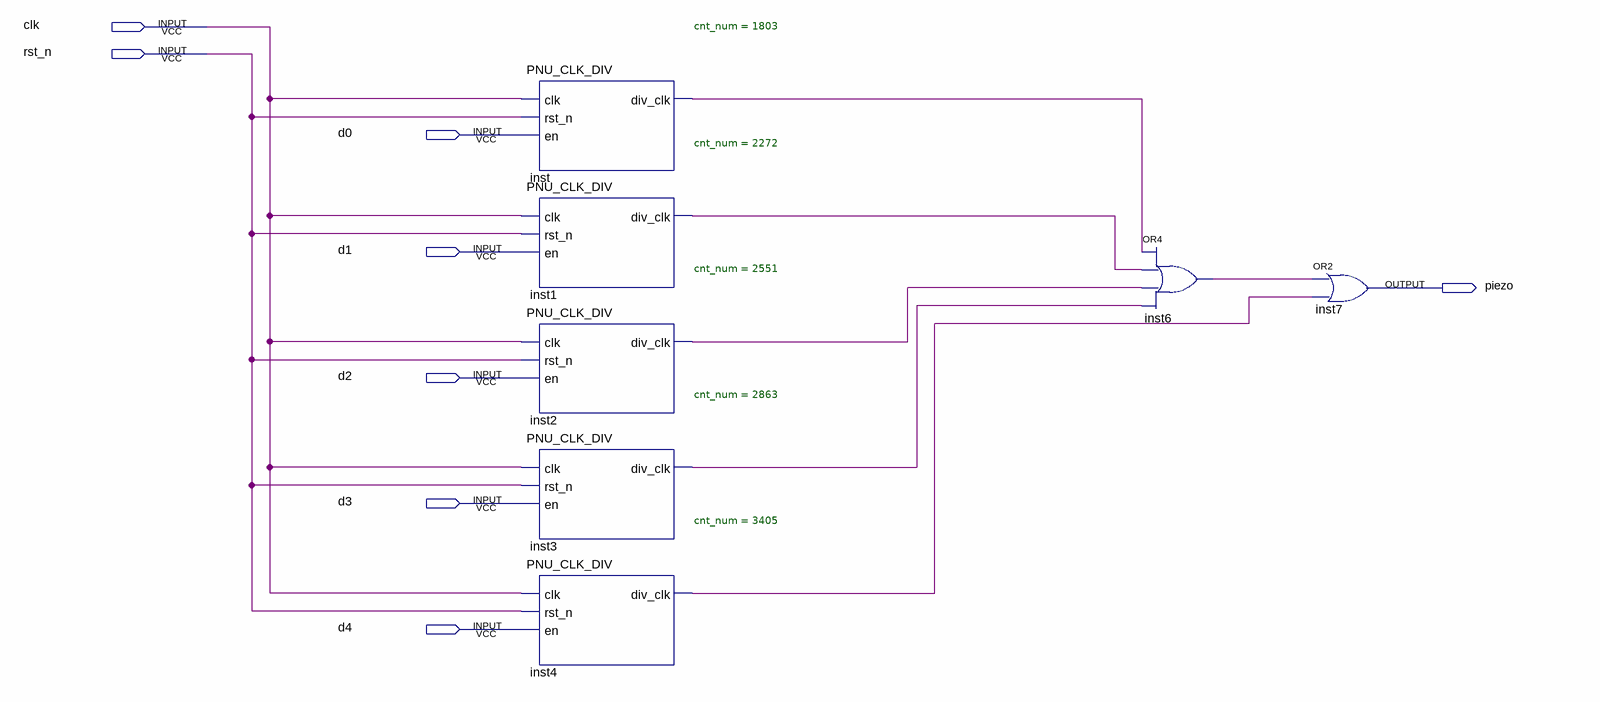
[diagram p0: schematic sheet]
// Quartus schematic bgm_hz.bdf as structural Verilog: 7 symbols, 8 pins
module bgm_hz (
  input  clk,
  input  rst_n,
  input  d0,
  input  d1,
  input  d2,
  input  d3,
  input  d4,
  output piezo
);

  wire inst1_div_clk, inst2_div_clk, inst3_div_clk, inst4_div_clk, inst6_out, inst_div_clk;

  PNU_CLK_DIV #(.cnt_num(1803)) inst (.clk(clk), .rst_n(rst_n), .en(d0), .div_clk(inst_div_clk));
  PNU_CLK_DIV #(.cnt_num(2272)) inst1 (.clk(clk), .rst_n(rst_n), .en(d1), .div_clk(inst1_div_clk));
  PNU_CLK_DIV #(.cnt_num(2551)) inst2 (.clk(clk), .rst_n(rst_n), .en(d2), .div_clk(inst2_div_clk));
  PNU_CLK_DIV #(.cnt_num(2863)) inst3 (.clk(clk), .rst_n(rst_n), .en(d3), .div_clk(inst3_div_clk));
  PNU_CLK_DIV #(.cnt_num(3405)) inst4 (.clk(clk), .rst_n(rst_n), .en(d4), .div_clk(inst4_div_clk));
  or inst6 (inst6_out, inst_div_clk, inst1_div_clk, inst2_div_clk, inst3_div_clk);
  or inst7 (piezo, inst6_out, inst4_div_clk);
endmodule
